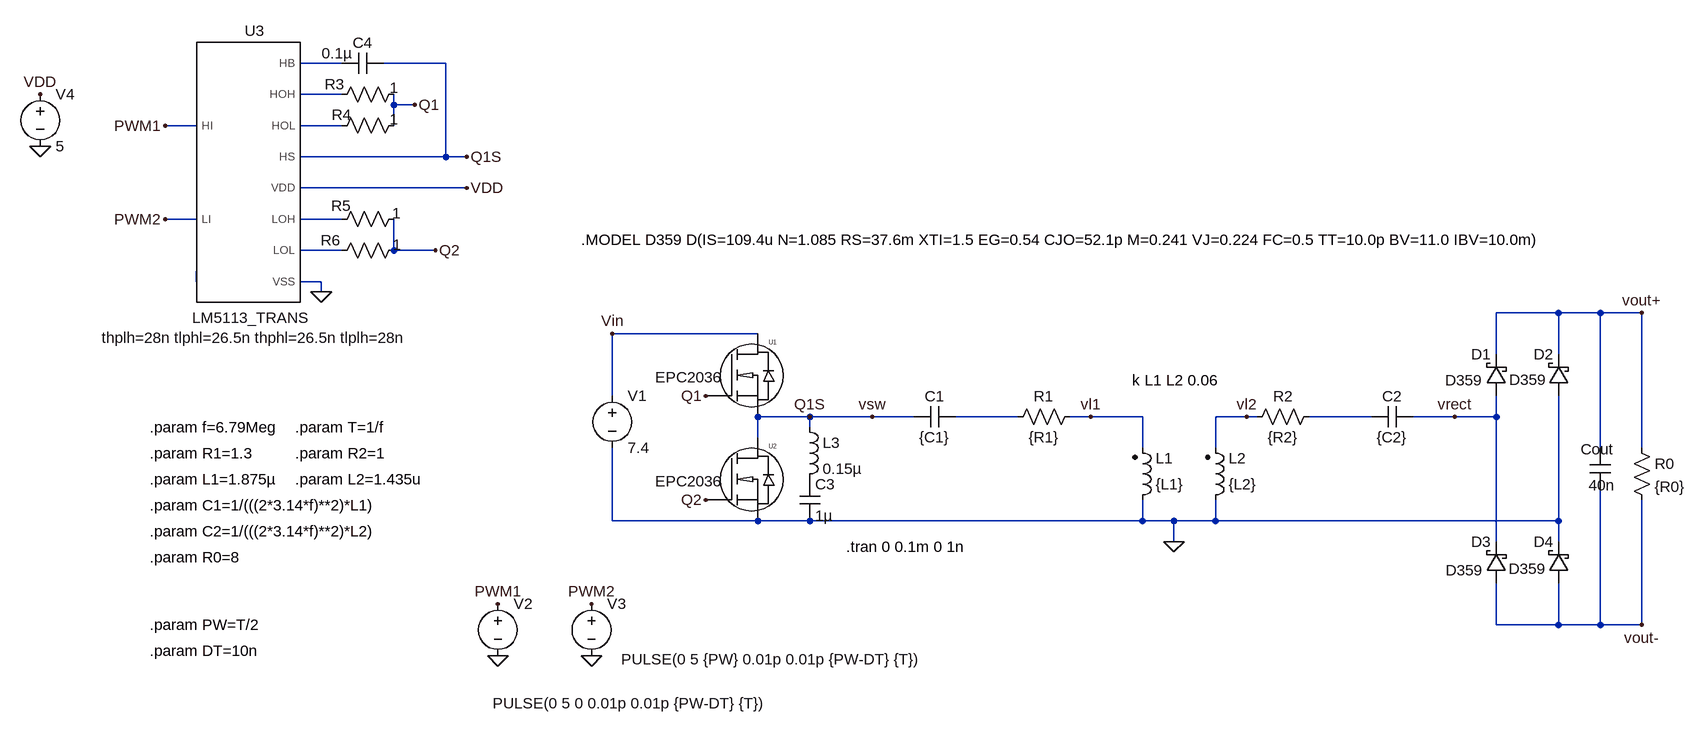
[diagram p0: schematic WPT_inv_rect_driver.asc]
WPT_inv_rect_driver.asc, the LTspice schematic file:
Version 4
SHEET 1 2368 1324
WIRE -1920 -48 -1984 -48
WIRE -1760 -48 -1856 -48
WIRE -1920 0 -1984 0
WIRE -1840 16 -1840 0
WIRE -1808 16 -1840 16
WIRE -2144 48 -2192 48
WIRE -1920 48 -1984 48
WIRE -1840 48 -1840 16
WIRE -1760 96 -1760 -48
WIRE -1760 96 -1984 96
WIRE -1728 96 -1760 96
WIRE -1728 144 -1984 144
WIRE -2144 192 -2192 192
WIRE -1920 192 -1984 192
WIRE -1920 240 -1984 240
WIRE -1840 240 -1840 192
WIRE -1776 240 -1840 240
WIRE -2144 288 -2144 272
WIRE -1952 288 -1984 288
WIRE -1952 304 -1952 288
WIRE -48 336 -144 336
WIRE 16 336 -48 336
WIRE 80 336 16 336
WIRE -1280 368 -1504 368
WIRE -144 400 -144 336
WIRE -48 400 -48 336
WIRE -1504 464 -1504 368
WIRE -1200 496 -1280 496
WIRE -1104 496 -1200 496
WIRE -1040 496 -1104 496
WIRE -880 496 -976 496
WIRE -768 496 -800 496
WIRE -688 496 -768 496
WIRE -528 496 -576 496
WIRE -512 496 -528 496
WIRE -336 496 -432 496
WIRE -208 496 -272 496
WIRE -144 496 -144 464
WIRE -144 496 -208 496
WIRE -1200 512 -1200 496
WIRE -1280 528 -1280 496
WIRE -688 544 -688 496
WIRE -576 544 -576 496
WIRE 16 544 16 336
WIRE 80 544 80 336
WIRE -1504 656 -1504 544
WIRE -1280 656 -1504 656
WIRE -1200 656 -1280 656
WIRE -688 656 -688 624
WIRE -688 656 -1200 656
WIRE -640 656 -688 656
WIRE -576 656 -576 624
WIRE -576 656 -640 656
WIRE -48 656 -48 464
WIRE -48 656 -576 656
WIRE -640 688 -640 656
WIRE -144 688 -144 496
WIRE -48 688 -48 656
WIRE -144 816 -144 752
WIRE -48 816 -48 752
WIRE -48 816 -144 816
WIRE 16 816 16 608
WIRE 16 816 -48 816
WIRE 80 816 80 624
WIRE 80 816 16 816
FLAG -640 688 0
FLAG -768 496 vl1
FLAG -528 496 vl2
FLAG -1360 464 Q1
FLAG -1360 624 Q2
FLAG -1200 496 Q1S
FLAG -1504 368 Vin
FLAG -1104 496 vsw
FLAG 80 336 vout+
FLAG 80 816 vout-
FLAG -208 496 vrect
FLAG -2384 0 VDD
FLAG -1808 16 Q1
FLAG -1776 240 Q2
FLAG -1728 96 Q1S
FLAG -2192 48 PWM1
FLAG -2192 192 PWM2
FLAG -1728 144 VDD
FLAG -1952 304 0
FLAG -2384 80 0
FLAG -1536 864 0
FLAG -1680 784 PWM1
FLAG -1536 784 PWM2
FLAG -1680 864 0
SYMBOL cap -976 480 R90
WINDOW 0 0 32 VBottom 2
WINDOW 3 32 32 VTop 2
SYMATTR InstName C1
SYMATTR Value {C1}
SYMBOL ind2 -704 640 M180
WINDOW 0 36 80 Left 2
WINDOW 3 36 40 Left 2
SYMATTR InstName L1
SYMATTR Value {L1}
SYMATTR Type ind
SYMBOL ind2 -592 640 M180
WINDOW 0 36 80 Left 2
WINDOW 3 36 40 Left 2
SYMATTR InstName L2
SYMATTR Value {L2}
SYMATTR Type ind
SYMBOL res -784 480 R90
WINDOW 0 0 56 VBottom 2
WINDOW 3 32 56 VTop 2
SYMATTR InstName R1
SYMATTR Value {R1}
SYMBOL res -416 480 R90
WINDOW 0 0 56 VBottom 2
WINDOW 3 32 56 VTop 2
SYMATTR InstName R2
SYMATTR Value {R2}
SYMBOL EPCGaN -1360 464 R0
WINDOW 3 -78 -29 Left 2
SYMATTR Value EPC2036
SYMATTR InstName U1
SYMBOL EPCGaN -1360 624 R0
WINDOW 3 -78 -29 Left 2
SYMATTR Value EPC2036
SYMATTR InstName U2
SYMBOL voltage -1504 448 R0
WINDOW 123 0 0 Left 0
WINDOW 39 0 0 Left 0
SYMATTR InstName V1
SYMATTR Value 7.4
SYMBOL cap -1216 592 R0
SYMATTR InstName C3
SYMATTR Value 1µ
SYMBOL ind -1216 496 R0
SYMATTR InstName L3
SYMATTR Value 0.15µ
SYMBOL cap -272 480 R90
WINDOW 0 0 32 VBottom 2
WINDOW 3 32 32 VTop 2
SYMATTR InstName C2
SYMATTR Value {C2}
SYMBOL res 64 528 R0
SYMATTR InstName R0
SYMATTR Value {R0}
SYMBOL cap 0 544 R0
WINDOW 0 -14 2 Left 2
WINDOW 3 -2 57 Left 2
SYMATTR InstName Cout
SYMATTR Value 40n
SYMBOL schottky -128 464 R180
WINDOW 0 24 64 Left 2
WINDOW 3 37 24 Left 2
SYMATTR InstName D1
SYMATTR Value D359
SYMBOL schottky -32 464 R180
WINDOW 0 24 64 Left 2
WINDOW 3 34 25 Left 2
SYMATTR InstName D2
SYMATTR Value D359
SYMBOL schottky -128 752 R180
WINDOW 0 24 64 Left 2
WINDOW 3 36 20 Left 2
SYMATTR InstName D3
SYMATTR Value D359
SYMBOL schottky -32 752 R180
WINDOW 0 24 64 Left 2
WINDOW 3 35 22 Left 2
SYMATTR InstName D4
SYMATTR Value D359
SYMBOL LM5113_TRANS -2048 224 R0
SYMATTR InstName U3
SYMBOL voltage -2384 -16 R0
WINDOW 123 0 0 Left 0
WINDOW 39 0 0 Left 0
SYMATTR InstName V4
SYMATTR Value 5
SYMBOL res -1824 -16 R90
WINDOW 0 16 107 VBottom 2
WINDOW 3 -10 16 VTop 2
SYMATTR InstName R3
SYMATTR Value 1
SYMBOL res -1824 32 R90
WINDOW 0 15 96 VBottom 2
WINDOW 3 -9 16 VTop 2
SYMATTR InstName R4
SYMATTR Value 1
SYMBOL res -1824 176 R90
WINDOW 0 11 97 VBottom 2
WINDOW 3 -9 12 VTop 2
SYMATTR InstName R5
SYMATTR Value 1
SYMBOL res -1824 224 R90
WINDOW 0 16 113 VBottom 2
WINDOW 3 -8 11 VTop 2
SYMATTR InstName R6
SYMATTR Value 1
SYMBOL cap -1856 -64 R90
WINDOW 0 0 32 VBottom 2
WINDOW 3 -15 71 VTop 2
SYMATTR InstName C4
SYMATTR Value 0.1µ
SYMBOL voltage -1680 768 R0
WINDOW 123 0 0 Left 0
WINDOW 39 0 0 Left 0
WINDOW 3 -8 169 Left 2
SYMATTR Value PULSE(0 5 0 0.01p 0.01p {PW-DT} {T})
SYMATTR InstName V2
SYMBOL voltage -1536 768 R0
WINDOW 123 0 0 Left 0
WINDOW 39 0 0 Left 0
WINDOW 3 46 101 Left 2
SYMATTR Value PULSE(0 5 {PW} 0.01p 0.01p {PW-DT} {T})
SYMATTR InstName V3
TEXT -704 440 Left 2 !k L1 L2 0.06
TEXT -1144 696 Left 2 !.tran 0 0.1m 0 1n
TEXT -2216 816 Left 2 !.param PW=T/2
TEXT -2216 856 Left 2 !.param DT=10n
TEXT -2216 592 Left 2 !.param L1=1.875µ
TEXT -2216 552 Left 2 !.param R1=1.3
TEXT -2216 632 Left 2 !.param C1=1/(((2*3.14*f)**2)*L1)
TEXT -2216 512 Left 2 !.param f=6.79Meg
TEXT -1992 512 Left 2 !.param T=1/f
TEXT -1992 552 Left 2 !.param R2=1
TEXT -1992 592 Left 2 !.param L2=1.435u
TEXT -2216 672 Left 2 !.param C2=1/(((2*3.14*f)**2)*L2)
TEXT -2216 712 Left 2 !.param R0=8
TEXT -1552 224 Left 2 !.MODEL D359 D(IS=109.4u N=1.085 RS=37.6m XTI=1.5 EG=0.54 CJO=52.1p M=0.241 VJ=0.224 FC=0.5 TT=10.0p BV=11.0 IBV=10.0m)

The netlist it stands for:
* WPT_inv_rect_driver.asc
C1 N007 vsw {C1}
L1 0 vl1 {L1}
L2 0 vl2 {L2}
R1 vl1 N007 {R1}
R2 N008 vl2 {R2}
XU1 Q1 Vin vsw EPC2036  ; pins gatein drainin N_0
XU2 Q2 vsw 0 EPC2036  ; pins gatein drainin N_0
V1 Vin 0 7.4
C3 P001 0 1µ
L3 vsw P001 0.15µ
C2 vrect N008 {C2}
R0 vout+ vout- {R0}
Cout vout+ vout- 40n
D1 vrect vout+ D359
D2 0 vout+ D359
D3 vout- vrect D359
D4 vout- 0 D359
XU3 N002 N003 N001 PWM1 vsw PWM2 N004 N005 VDD 0 LM5113_TRANS thplh=28n tlphl=26.5n thphl=26.5n tlplh=28n  ; pins HOH HOL HB HI HS LI LOH LOL VDD VSS
V4 VDD 0 5
R3 Q1 N002 1
R4 Q1 N003 1
R5 Q2 N004 1
R6 Q2 N005 1
C4 vsw N001 0.1µ
V2 PWM1 0 PULSE(0 5 0 0.01p 0.01p {PW-DT} {T})
V3 PWM2 0 PULSE(0 5 {PW} 0.01p 0.01p {PW-DT} {T})
.model D D
.lib standard.dio
k L1 L2 0.06
.tran 0 0.1m 0 1n
.param PW=T/2
.param DT=10n
.param L1=1.875µ
.param R1=1.3
.param C1=1/(((2*3.14*f)**2)*L1)
.param f=6.79Meg
.param T=1/f
.param R2=1
.param L2=1.435u
.param C2=1/(((2*3.14*f)**2)*L2)
.param R0=8
.MODEL D359 D(IS=109.4u N=1.085 RS=37.6m XTI=1.5 EG=0.54 CJO=52.1p M=0.241 VJ=0.224 FC=0.5 TT=10.0p BV=11.0 IBV=10.0m)
.lib EPCGanlibrary.lib
.lib LM5113_TRANS.lib
.backanno
.end